# Altium schematic sheet Connector and Regulators.SchDoc
size A
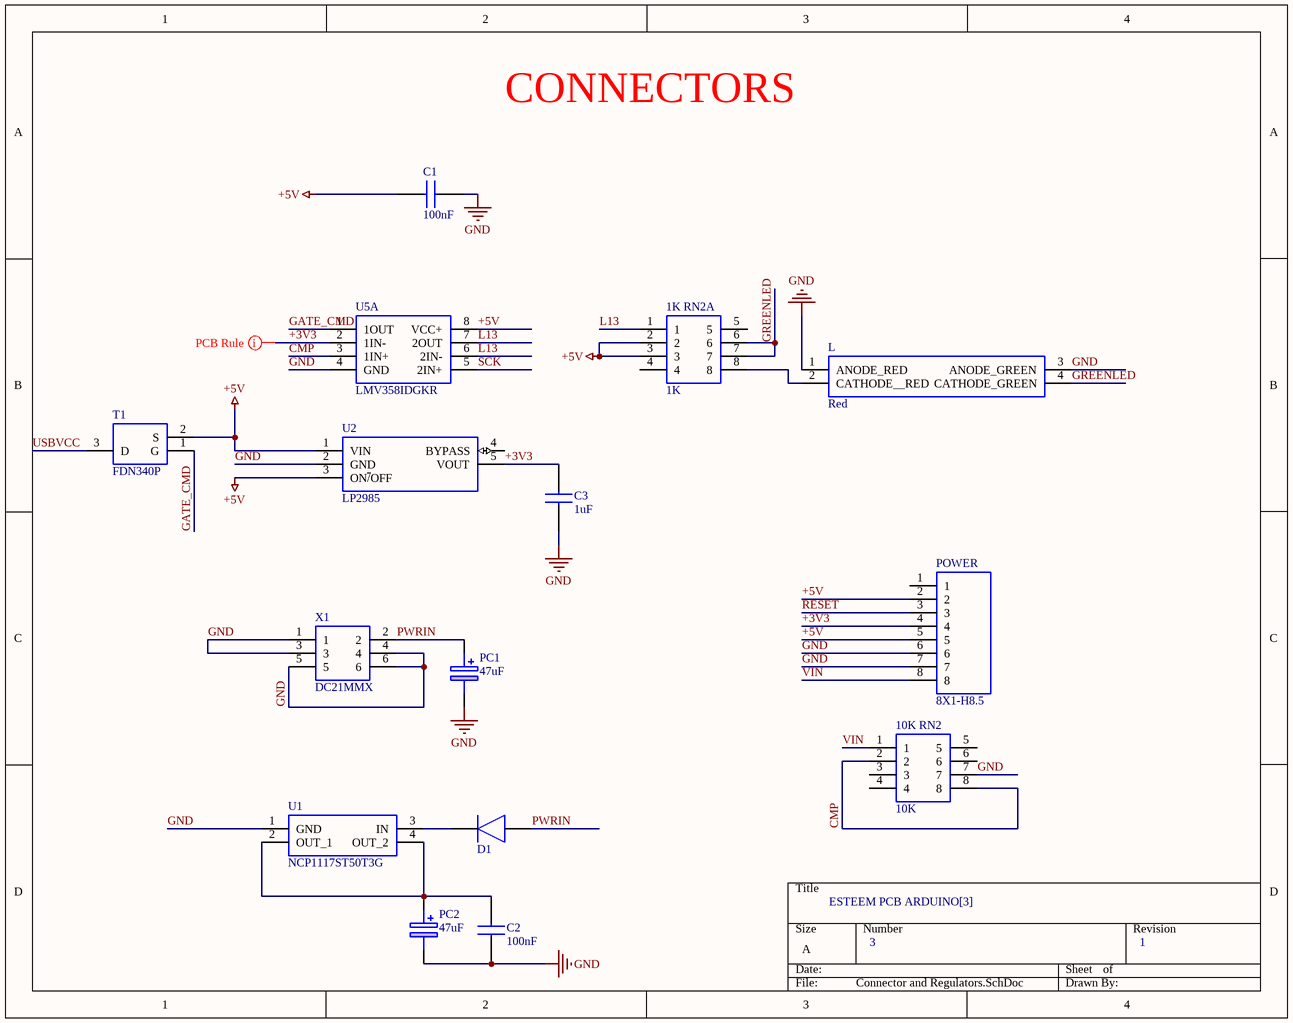
[diagram p0: Connector and Regulators.SchDoc]

## Parts
1K_RN2A  1K  [CAY10-XXXJ4]
10K_RN2  10K  [CAY10-XXXJ4]
C1  100nF  [CAPC2012X130N]
C2  100nF  [CAPC2012X130N]
C3  1uF  [CAPC2012X145N]
D1  CD1206-S01575  [DIOC3016X65N]  (value not drawn)
L  Red  [SML522MD8WT86]
PC1  47uF  [CAPAE530X610N]
PC2  47uF  [CAPAE530X610N]
POWER  8X1-H8.5  [HDRV8W90P0X254_1X8_2032X249X560P]
T1  FDN340P  [SOT95P251X112-3N]
U1  NCP1117ST50T3G  [SOT230P700X180-4N]
U2  LP2985  [SOT95P280X145-5N]
U5A  LMV358IDGKR  [SOP65P490X110-8N]
X1  DC21MMX  [USBBSRA]

## Nets
+5V: 1K_RN2A.2 1K_RN2A.3 C1.1 POWER.2 POWER.5 T1.2(S) U2.1(VIN) U2.3(ON~{/}OFF) U5A.8(VCC+)
GND: 10K_RN2.7 C1.2 C2.1 C3.1 L.1(ANODE_RED) L.3(ANODE_GREEN) PC1.2(-) PC2.2(-) POWER.6 POWER.7 U1.1(GND) U2.2(GND) U5A.4(GND) X1.1 X1.3 X1.4 X1.5 X1.6
+3V3: C3.2 POWER.4 U2.5(VOUT) U5A.2(1IN-)
CMP: 10K_RN2.2 10K_RN2.8 U5A.3(1IN+)
GATE_CMD: T1.1(G) U5A.1(1OUT)
GREENLED: 1K_RN2A.6 1K_RN2A.7 L.4(CATHODE_GREEN)
L13: 1K_RN2A.1 U5A.6(2IN-) U5A.7(2OUT)
PWRIN: D1.2(A) PC1.1(+) X1.2
RESET: POWER.3
SCK: U5A.5(2IN+)
USBVCC: T1.3(D)
VIN: 10K_RN2.1 POWER.8
Net1K_RN2A_8: 1K_RN2A.8 L.2(CATHODE__RED)
NetC2_2: C2.2 PC2.1(+) U1.2(OUT_1) U1.4(OUT_2)
NetD1_1: D1.1(K) U1.3(IN)

Not connected (* = marked no-connect by the designer): 1K_RN2A 4 5; 10K_RN2 3 4 5 6; POWER 1; U2 4(BYPASS)

## Layout directives
rule Width Constraint [Pref Width = 11.811mil    Min Width = 11.811mil    Max Width = 11.811mil]: +3V3

## Notes on the sheet
- CONNECTORS
- ESTEEM PCB ARDUINO[3]
- 3
- 1

## Library data of the parts
1K_RN2A 10K_RN2 = CAY10-220J4LF: CAY10 convex chip resistor array,22R Bourns CAY10 Series 22 5% Isolated SMT Resistor Array, 4 Resistors, 0.125W total 0804 package Convex; Allied_Number: 70276318; Manufacturer_Name: Bourns; Manufacturer_Part_Number: CAY10-220J4LF; RS Part Number: 1674746; RS Price/Stock: http://uk.rs-online.com/web/p/products/1674746; Allied Price/Stock: https://www.alliedelec.com/bourns-cay10-220j4lf/70276318/; Mouser Part Number: 652-CAY10-220J4LF; Mouser Price/Stock: https://www.mouser.com/Search/Refine.aspx?Keyword=652-CAY10-220J4LF; Datasheet Link: http://docs-emea.rs-online.com/webdocs/064e/0900766b8064e463.pdf
C1 C2 = 0805Y0500104KXT: Syfer Technology 0805 Flexicap 100nF Ceramic Multilayer Capacitor, 50 V, +125C, X7R Dielectric, 10% SMD; Geometry.Height: 1.3mm; Manufacturer_Name: Syfer; Manufacturer_Part_Number: 0805Y0500104KXT; RS Part Number: 7738389P; RS Price/Stock: http://uk.rs-online.com/web/p/products/7738389P; Mouser Part Number: 7738389P; Mouser Price/Stock: http://uk.rs-online.com/web/p/products/7738389P; Datasheet Link: http://docs-emea.rs-online.com/webdocs/119d/0900766b8119d7bc.pdf
C3 = C2012C0G2A103J125AA: Multilayer Ceramic Capacitors MLCC - SMD/SMT 0805 C0G 100volts 0.01uF 5% 1.25mm; Manufacturer_Name: TDK; Geometry.Height: 1.45mm; Manufacturer_Part_Number: C2012C0G2A103J125AA; RS Part Number: *; RS Price/Stock: *; Mouser Part Number: 810-C2012C0G2A103JAA; Mouser Price/Stock: https://www.mouser.com/Search/Refine.aspx?Keyword=810-C2012C0G2A103JAA; Datasheet Link: https://product.tdk.com/info/en/catalog/datasheets/mlcc_commercial_midvoltage_en.pdf
D1 = CD1206-S01575: Diode Switching 100V 0.15A 4ns SMD1206 Bourns CD1206-S01575 Switching Diode, 150mA, 100V, 4ns, 2-Pin 1206; Allied_Number: 70154675; Geometry.Height: 0.65mm; Manufacturer_Name: Bourns; Manufacturer_Part_Number: CD1206-S01575; RS Part Number: 1775431; RS Price/Stock: http://uk.rs-online.com/web/p/products/1775431; Allied Price/Stock: http://www.alliedelec.com/bourns-cd1206-s01575/70154675/; Mouser Part Number: 652-CD1206-S01575; Mouser Price/Stock: https://www.mouser.com/Search/Refine.aspx?Keyword=652-CD1206-S01575; Datasheet Link: http://docs-emea.rs-online.com/webdocs/1189/0900766b811897a9.pdf
L = SML-522MU8WT86: Dual color mini-mold Chip LED: ROHM's chip LED lineup consists of standard type,top-view type, side-view type and reverse-mount type.; Manufacturer_Name: ROHM Semiconductor; Geometry.Height: 0mm; Manufacturer_Part_Number: SML-522MU8WT86; RS Part Number: 1682468; RS Price/Stock: http://uk.rs-online.com/web/p/products/1682468; Mouser Part Number: 755-SML-522MU8WT86; Mouser Price/Stock: https://www.mouser.com/Search/Refine.aspx?Keyword=755-SML-522MU8WT86; Datasheet Link: https://www.rohm.com/datasheet/SML-522MU8W/sml-52-e
PC1 PC2 = EEE-FT1V470AR: Aluminum Electrolytic Capacitors - SMD 47uF 35volts 5x5.8mm SMD; Manufacturer_Name: Panasonic; Allied_Number: 70258388; Geometry.Height: 6.1mm; Manufacturer_Part_Number: EEE-FT1V470AR; RS Part Number: *; RS Price/Stock: *; Allied Price/Stock: https://www.alliedelec.com/panasonic-eee-ft1v470ar/70258388/; Mouser Part Number: 667-EEE-FT1V470AR; Mouser Price/Stock: https://www.mouser.com/Search/Refine.aspx?Keyword=667-EEE-FT1V470AR; Datasheet Link: https://industrial.panasonic.com/cdbs/www-data/pdf/RDE0000/ABA0000C1240.pdf
POWER = 90120-0768: 8 way single row straight header Molex C-GRID III Series, Series Number 90120, 2.54mm Pitch 8 Way 1 Row Straight Pin Header, Through Hole; Allied_Number: 70372836; Geometry.Height: 5.6mm; Manufacturer_Name: Molex; Manufacturer_Part_Number: 90120-0768; RS Part Number: 1671900; RS Price/Stock: http://uk.rs-online.com/web/p/products/1671900; Allied Price/Stock: https://www.alliedelec.com/molex-incorporated-90120-0768/70372836/; Mouser Part Number: 538-90120-0768; Mouser Price/Stock: https://www.mouser.com/Search/Refine.aspx?Keyword=538-90120-0768; Datasheet Link: http://www.molex.com/molex/products/datasheet.jsp?part=active/0901200768_PCB_HEADERS.xml
T1 = FDN340P: FDN340P, P-channel MOSFET Transistor 2 A 20 V, 3-Pin SuperSOT; Manufacturer_Name: Fairchild Semiconductor; Geometry.Height: 1.12mm; Manufacturer_Part_Number: FDN340P; RS Part Number: 6710435P; RS Price/Stock: http://uk.rs-online.com/web/p/products/6710435P; Mouser Part Number: 512-FDN340P; Mouser Price/Stock: https://www.mouser.com/Search/Refine.aspx?Keyword=512-FDN340P; Datasheet Link: http://docs-emea.rs-online.com/webdocs/0d23/0900766b80d23111.pdf
U1 = NCP1117ST50T3G: ON SEMICONDUCTOR - NCP1117ST50T3G - LDO, REG, 20VIN, 1A, 5V, 1%, SOT223-3; Allied_Number: 70466898; Geometry.Height: 1.8mm; Manufacturer_Name: ON Semiconductor; Manufacturer_Part_Number: NCP1117ST50T3G; RS Part Number: 8022130P; RS Price/Stock: http://uk.rs-online.com/web/p/products/8022130P; Allied Price/Stock: http://www.alliedelec.com/on-semiconductor-ncp1117st50t3g/70466898/; Mouser Part Number: 863-NCP1117ST50T3G; Mouser Price/Stock: https://www.mouser.com/Search/Refine.aspx?Keyword=863-NCP1117ST50T3G; Datasheet Link: http://www.onsemi.com/pub/Collateral/NCP1117-D.PDF
U2 = LP2985-33DBVR: 150-mA Low-noise Low-dropout Regulator With Shutdown; Manufacturer_Name: Texas Instruments; Geometry.Height: 1.45mm; Manufacturer_Part_Number: LP2985-33DBVR; RS Part Number: *; RS Price/Stock: *; Mouser Part Number: 595-LP2985-33DBVR; Mouser Price/Stock: https://www.mouser.com/Search/Refine.aspx?Keyword=595-LP2985-33DBVR; Datasheet Link: http://www.ti.com/lit/gpn/lp2985
U5A = LMV358IDGKR: OP Amp Dual GP R-R O/P 5.5V 8-Pin MSOP Texas Instruments LMV358IDGKR, Dual Op Amp, 1MHz CMOS, Rail to Rail, 3 V, 5 V, 8-Pin MSOP; Geometry.Height: 1.1mm; Manufacturer_Name: Texas Instruments; Manufacturer_Part_Number: LMV358IDGKR; RS Part Number: 1625114; RS Price/Stock: http://uk.rs-online.com/web/p/products/1625114; Mouser Part Number: 595-LMV358IDGKR; Mouser Price/Stock: https://www.mouser.com/Search/Refine.aspx?Keyword=595-LMV358IDGKR; Datasheet Link: http://www.ti.com/lit/ds/symlink/lmv358.pdf
X1 = USB-B-S-RA: MULTICOMP - USB-B-S-RA - USB, 2.0 TYPE B, RECEPTACLE, TH; Geometry.Height: 10mm; Manufacturer_Name: MULTICOMP; Manufacturer_Part_Number: USB-B-S-RA; RS Part Number: *; RS Price/Stock: *; Mouser Part Number: *; Mouser Price/Stock: *; Datasheet Link: http://www.farnell.com/datasheets/1788391.pdf